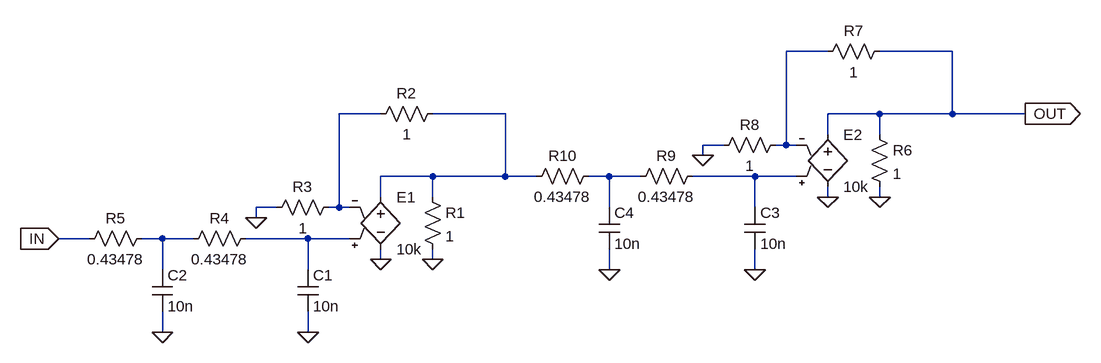
[diagram p0: schematic filter.asc]
filter.asc, the LTspice schematic file:
Version 4
SHEET 1 1516 680
WIRE 992 -208 928 -208
WIRE 1184 -208 1072 -208
WIRE 304 -112 240 -112
WIRE 496 -112 384 -112
WIRE 1072 -112 992 -112
WIRE 1184 -112 1184 -208
WIRE 1184 -112 1072 -112
WIRE 1296 -112 1184 -112
WIRE 992 -80 992 -112
WIRE 1072 -80 1072 -112
WIRE 832 -64 800 -64
WIRE 928 -64 928 -208
WIRE 928 -64 912 -64
WIRE 944 -64 928 -64
WIRE 800 -48 800 -64
WIRE 384 -16 304 -16
WIRE 496 -16 496 -112
WIRE 496 -16 384 -16
WIRE 544 -16 496 -16
WIRE 656 -16 624 -16
WIRE 704 -16 656 -16
WIRE 880 -16 784 -16
WIRE 944 -16 880 -16
WIRE 304 16 304 -16
WIRE 384 16 384 -16
WIRE 992 16 992 0
WIRE 1072 16 1072 0
WIRE 144 32 112 32
WIRE 240 32 240 -112
WIRE 240 32 224 32
WIRE 256 32 240 32
WIRE 656 32 656 -16
WIRE 880 32 880 -16
WIRE 112 48 112 32
WIRE -144 80 -192 80
WIRE -32 80 -64 80
WIRE 16 80 -32 80
WIRE 192 80 96 80
WIRE 256 80 192 80
WIRE 304 112 304 96
WIRE 384 112 384 96
WIRE -32 128 -32 80
WIRE 192 128 192 80
WIRE 656 128 656 96
WIRE 880 128 880 96
WIRE -32 224 -32 192
WIRE 192 224 192 192
FLAG 304 112 0
FLAG 384 112 0
FLAG 112 48 0
FLAG 192 224 0
FLAG -32 224 0
FLAG 992 16 0
FLAG 1072 16 0
FLAG 1296 -112 OUT
IOPIN 1296 -112 Out
FLAG 800 -48 0
FLAG 880 128 0
FLAG 656 128 0
FLAG -192 80 IN
IOPIN -192 80 In
SYMBOL res 368 0 R0
SYMATTR InstName R1
SYMATTR Value 1
SYMBOL e2 304 0 R0
SYMATTR InstName E1
SYMATTR Value 10k
SYMBOL res 400 -128 R90
WINDOW 0 0 56 VBottom 2
WINDOW 3 32 56 VTop 2
SYMATTR InstName R2
SYMATTR Value 1
SYMBOL res 240 16 R90
WINDOW 0 0 56 VBottom 2
WINDOW 3 32 56 VTop 2
SYMATTR InstName R3
SYMATTR Value 1
SYMBOL res 112 64 R90
WINDOW 0 0 56 VBottom 2
WINDOW 3 32 56 VTop 2
SYMATTR InstName R4
SYMATTR Value 0.43478
SYMBOL cap 176 128 R0
SYMATTR InstName C1
SYMATTR Value 10n
SYMBOL cap -48 128 R0
SYMATTR InstName C2
SYMATTR Value 10n
SYMBOL res -48 64 R90
WINDOW 0 0 56 VBottom 2
WINDOW 3 32 56 VTop 2
SYMATTR InstName R5
SYMATTR Value 0.43478
SYMBOL res 1056 -96 R0
SYMATTR InstName R6
SYMATTR Value 1
SYMBOL e2 992 -96 R0
SYMATTR InstName E2
SYMATTR Value 10k
SYMBOL res 1088 -224 R90
WINDOW 0 0 56 VBottom 2
WINDOW 3 32 56 VTop 2
SYMATTR InstName R7
SYMATTR Value 1
SYMBOL res 928 -80 R90
WINDOW 0 0 56 VBottom 2
WINDOW 3 32 56 VTop 2
SYMATTR InstName R8
SYMATTR Value 1
SYMBOL res 800 -32 R90
WINDOW 0 0 56 VBottom 2
WINDOW 3 32 56 VTop 2
SYMATTR InstName R9
SYMATTR Value 0.43478
SYMBOL cap 864 32 R0
SYMATTR InstName C3
SYMATTR Value 10n
SYMBOL cap 640 32 R0
SYMATTR InstName C4
SYMATTR Value 10n
SYMBOL res 640 -32 R90
WINDOW 0 0 56 VBottom 2
WINDOW 3 32 56 VTop 2
SYMATTR InstName R10
SYMATTR Value 0.43478

The netlist it stands for:
* filter.asc
R1 N003 0 1
E1 N003 0 N007 N002 10k
R2 N003 N002 1
R3 N002 0 1
R4 N007 N006 0.43478
C1 N007 0 10n
C2 N006 0 10n
R5 N006 IN 0.43478
R6 OUT 0 1
E2 OUT 0 N005 N001 10k
R7 OUT N001 1
R8 N001 0 1
R9 N005 N004 0.43478
C3 N005 0 10n
C4 N004 0 10n
R10 N004 N003 0.43478
.backanno
.end